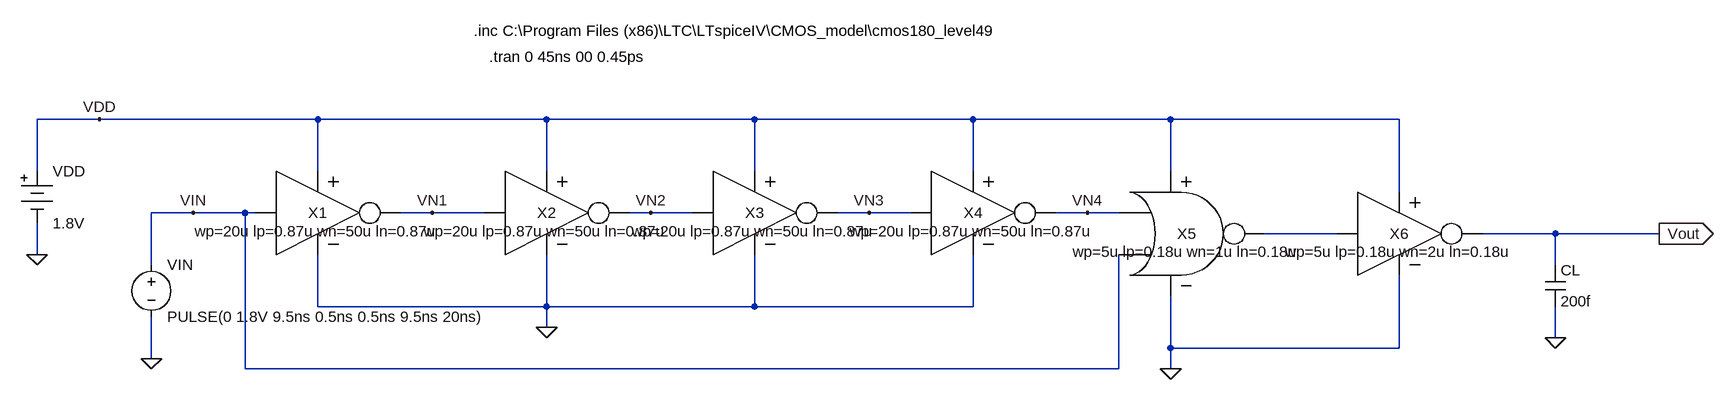
[diagram p0: schematic lab2.asc]
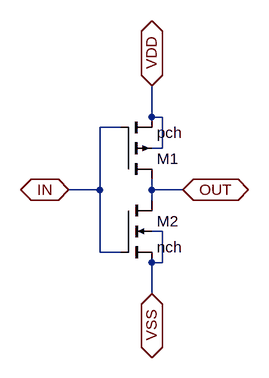
[diagram p1: sub-circuit inv.asc]
lab2.asc, the LTspice schematic file:
Version 4
SHEET 1 2472 772
WIRE -128 64 -224 64
WIRE 208 64 -128 64
WIRE 560 64 208 64
WIRE 880 64 560 64
WIRE 1216 64 880 64
WIRE 1520 64 1216 64
WIRE 1872 64 1520 64
WIRE -224 144 -224 64
WIRE 208 144 208 64
WIRE 560 144 560 64
WIRE 880 144 880 64
WIRE 1216 144 1216 64
WIRE 1520 144 1520 64
WIRE 1872 176 1872 64
WIRE 16 208 -48 208
WIRE 96 208 16 208
WIRE 112 208 96 208
WIRE 384 208 336 208
WIRE 464 208 384 208
WIRE 720 208 688 208
WIRE 784 208 720 208
WIRE 1056 208 1008 208
WIRE 1120 208 1056 208
WIRE 1392 208 1344 208
WIRE 1440 208 1392 208
WIRE 1776 240 1664 240
WIRE 2112 240 2000 240
WIRE 2272 240 2112 240
WIRE -224 272 -224 224
WIRE -48 288 -48 208
WIRE 2112 288 2112 240
WIRE 208 352 208 272
WIRE 560 352 560 272
WIRE 560 352 208 352
WIRE 880 352 880 272
WIRE 880 352 560 352
WIRE 1216 352 1216 272
WIRE 1216 352 880 352
WIRE 560 384 560 352
WIRE 2112 400 2112 352
WIRE 1520 416 1520 336
WIRE 1872 416 1872 304
WIRE 1872 416 1520 416
WIRE -48 432 -48 368
WIRE 96 448 96 208
WIRE 1440 448 1440 272
WIRE 1440 448 96 448
WIRE 1520 448 1520 416
FLAG 2112 400 0
FLAG 2272 240 Vout
IOPIN 2272 240 Out
FLAG -48 432 0
FLAG -224 272 0
FLAG 1520 448 0
FLAG 560 384 0
FLAG 384 208 VN1
FLAG 720 208 VN2
FLAG 1056 208 VN3
FLAG -128 64 VDD
FLAG 16 208 VIN
FLAG 1392 208 VN4
SYMBOL Misc\\battery -224 128 R0
WINDOW 123 0 0 Left 2
WINDOW 39 0 0 Left 2
SYMATTR InstName VDD
SYMATTR Value 1.8V
SYMBOL cap 2096 288 R0
SYMATTR InstName CL
SYMATTR Value 200f
SYMBOL voltage -48 272 R0
WINDOW 123 0 0 Left 2
WINDOW 39 0 0 Left 2
SYMATTR InstName VIN
SYMATTR Value PULSE(0 1.8V 9.5ns 0.5ns 0.5ns 9.5ns 20ns)
SYMBOL inv 208 208 R0
WINDOW 39 0 28 Center 2
SYMATTR SpiceLine wp=20u lp=0.87u wn=50u ln=0.87u
SYMATTR InstName X1
SYMBOL inv 560 208 R0
WINDOW 39 0 28 Center 2
SYMATTR SpiceLine wp=20u lp=0.87u wn=50u ln=0.87u
SYMATTR InstName X2
SYMBOL inv 880 208 R0
WINDOW 39 0 28 Center 2
SYMATTR SpiceLine wp=20u lp=0.87u wn=50u ln=0.87u
SYMATTR InstName X3
SYMBOL inv 1216 208 R0
WINDOW 39 0 28 Center 2
SYMATTR SpiceLine wp=20u lp=0.87u wn=50u ln=0.87u
SYMATTR InstName X4
SYMBOL nor2 1536 240 R0
WINDOW 39 9 28 Center 2
SYMATTR SpiceLine wp=5u lp=0.18u wn=1u ln=0.18u
SYMATTR InstName X5
SYMBOL inv 1872 240 R0
WINDOW 39 0 28 Center 2
SYMATTR SpiceLine wp=5u lp=0.18u wn=2u ln=0.18u
SYMATTR InstName X6
TEXT 448 -72 Left 2 !.inc C:\\Program Files (x86)\\LTC\\LTspiceIV\\CMOS_model\\cmos180_level49
TEXT 472 -32 Left 2 !.tran 0 45ns 00 0.45ps

inv.asc, the sub-circuit schematic file:
Version 4
SHEET 1 880 680
WIRE 240 32 240 -16
WIRE 256 32 240 32
WIRE 192 48 160 48
WIRE 256 80 256 32
WIRE 256 80 240 80
WIRE 160 144 160 48
WIRE 160 144 112 144
WIRE 240 144 240 128
WIRE 288 144 240 144
WIRE 240 160 240 144
WIRE 256 208 240 208
WIRE 160 240 160 144
WIRE 192 240 160 240
WIRE 256 256 256 208
WIRE 256 256 240 256
WIRE 240 304 240 256
FLAG 112 144 IN
IOPIN 112 144 BiDir
FLAG 288 144 OUT
IOPIN 288 144 BiDir
FLAG 240 -16 VDD
IOPIN 240 -16 BiDir
FLAG 240 304 VSS
IOPIN 240 304 BiDir
SYMBOL pmos4 192 128 M180
SYMATTR InstName M1
SYMATTR Value pch
SYMATTR Value2 l=lp w=wp
SYMBOL nmos4 192 160 R0
SYMATTR InstName M2
SYMATTR Value nch
SYMATTR Value2 l=ln w=wn

The netlist it stands for:
* lab2.asc
VDD VDD 0 1.8V
CL Vout 0 200f
VIN VIN 0 PULSE(0 1.8V 9.5ns 0.5ns 0.5ns 9.5ns 20ns)
XX1 VIN VN1 VDD 0 inv params: wp=20u lp=0.87u wn=50u ln=0.87u
XX2 VN1 VN2 VDD 0 inv params: wp=20u lp=0.87u wn=50u ln=0.87u
XX3 VN2 VN3 VDD 0 inv params: wp=20u lp=0.87u wn=50u ln=0.87u
XX4 VN3 VN4 VDD 0 inv params: wp=20u lp=0.87u wn=50u ln=0.87u
XX5 VN4 VIN N001 VDD 0 nor2 params: wp=5u lp=0.18u wn=1u ln=0.18u  ; pins A B Y VDD VSS
XX6 N001 Vout VDD 0 inv params: wp=5u lp=0.18u wn=2u ln=0.18u

* block symbol definitions
.subckt inv IN OUT VDD VSS
M1 OUT IN VDD VDD pch l=lp w=wp
M2 OUT IN VSS VSS nch l=ln w=wn
.ends inv

.model NMOS NMOS
.model PMOS PMOS
.lib standard.mos
.inc C:\Program Files (x86)\LTC\LTspiceIV\CMOS_model\cmos180_level49
.tran 0 45ns 00 0.45ps
.backanno
.end

* Results of the author's LTspice run, read from the files saved beside the schematic
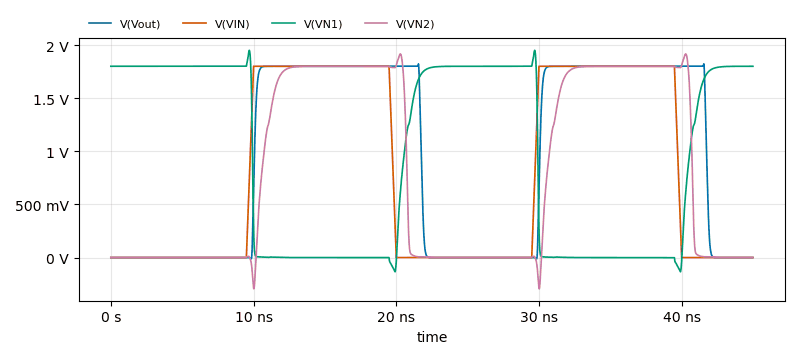
[diagram p2: Transient Analysis of lab2.asc, plotted from the saved traces]
* Transient Analysis, 1 run:
*   V(Vout): min -12.05 mV, max 1.823 V, average 936.6 mV, rms 1.29 V, last 0 V
*   V(VIN): min 0 V, max 1.8 V, average 800 mV, rms 1.19 V, last 0 V
*   V(VN1): min -133.9 mV, max 1.95 V, average 942.6 mV, rms 1.286 V, last 1.8 V
*   V(VN2): min -294 mV, max 1.916 V, average 792.6 mV, rms 1.175 V, last 3.499 µV